# EAGLE design fra_500k_4M (EAGLE 9.6.2)
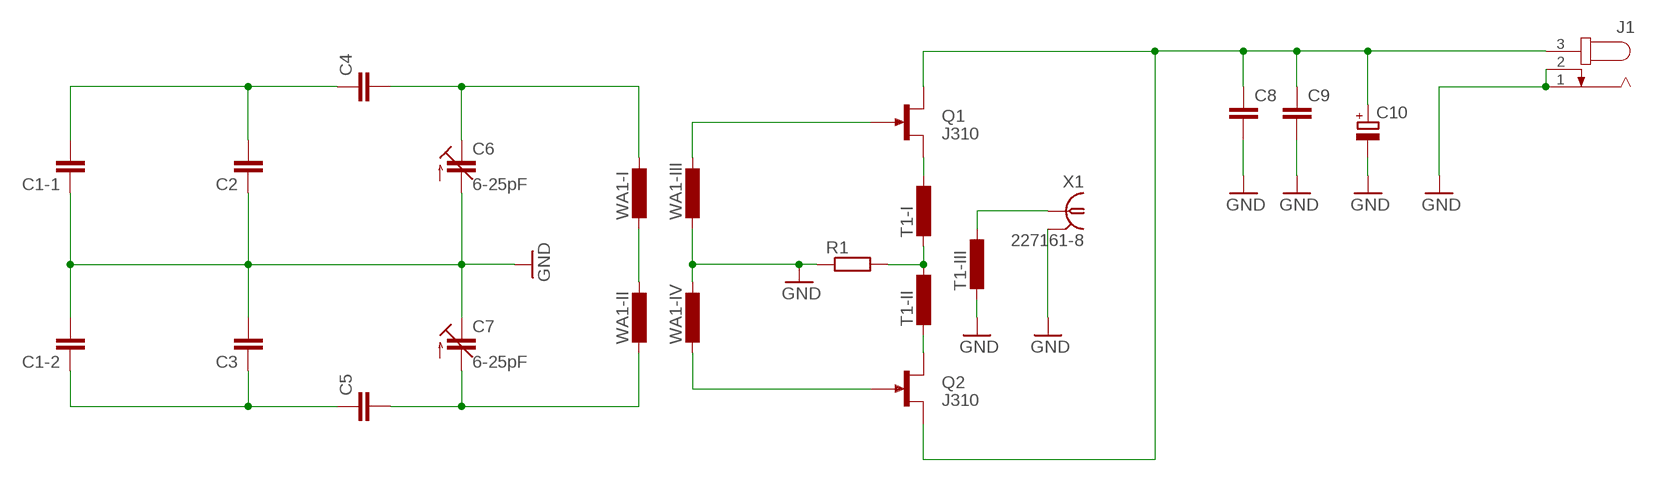
[diagram p0: schematic, sheet 1]

## Parts
C1-1  C-EU075-032X103  [C075-032X103]
C1-2  C-EU075-032X103  [C075-032X103]
C2  C-EUC1210  [C1210]
C3  C-EUC1210  [C1210]
C4  C-EUC1210  [C1210]
C5  C-EUC1210  [C1210]
C6  6-25pF  C-TRIMM3050.504  [CTRIM3050.504]
C7  6-25pF  C-TRIMM3050.504  [CTRIM3050.504]
C8  C-EUC1206  [C1206]
C9  C-EUC1206  [C1206]
C10  CPOL-EUSMCC  [SMC_C]
J1  JACK-PLUG0  [SPC4077]
Q1  J310  [TO92R]
Q2  J310  [TO92R]
R1  R-EU_M1206  [M1206]
T1-I  L-EU0204/7  [0204/7]
T1-II  L-EU0204/7  [0204/7]
T1-III  L-EU0204/7  [0204/7]
WA1-I  L-EU0204/7  [0204/7]
WA1-II  L-EU0204/7  [0204/7]
WA1-III  L-EU0204/7  [0204/7]
WA1-IV  L-EU0204/7  [0204/7]
X1  227161-8  [AMP_227161]

## Nets
GND: C1-1.1 C1-2.2 C2.1 C3.2 C6.2(A) C7.1(E) C8.2 C9.2 C10.- J1.1 J1.2 R1.1 T1-III.2 WA1-III.2 WA1-IV.1 X1.2
N$1: Q1.G WA1-III.1
N$2: Q2.G WA1-IV.2
N$3: T1-III.1 X1.1
N$4: Q1.S T1-I.1
N$5: R1.2 T1-I.2 T1-II.1
N$6: Q2.D T1-II.2
N$7: C8.1 C9.1 C10.+ J1.3 Q1.D Q2.S
N$8: C4.2 C6.1(E) WA1-I.1
N$9: C1-1.2 C2.2 C4.1
N$11: C1-2.1 C3.1 C5.1
N$12: C5.2 C7.2(A) WA1-II.2
N$13: WA1-I.2 WA1-II.1

## Library data of the parts
C1-1 C1-2 C2-C5 C8 C9 = rcl:C-EU: CAPACITOR, European symbol; SPICEPREFIX: C
C6 C7 = rcl:C-TRIMM: Trimm capacitor; SPICEPREFIX: C
C10 = rcl:CPOL-EU: POLARIZED CAPACITOR, European symbol; SPICEPREFIX: C
J1 = con-jack:JACK-PLUG: DC POWER JACK Power Jack, DC, Right Angle, Through Hole, Rated 5A at 16VDC, PC Terminals Distributor: Farnell (www.Farnell.de) Drawing: 84N1161.pdf / 84N1162.pdf Manufacturer: SPC Technology (www.spctechnology.com) Type: SPC4077 / SPC 4078; OC_FARNELL: unknown; OC_NEWARK: unknown
Q1 Q2 = transistor-small-signal:J310: N-Channel RF Amplifier J309, J310 Source: http://www.fairchildsemi.com/pf/J3/J310.html
R1 = rcl:R-EU_: RESISTOR, European symbol; SPICEPREFIX: R
T1-I T1-II T1-III WA1-I WA1-II WA1-III WA1-IV = rcl:L-EU: INDUCTOR, European symbol; SPICEPREFIX: L
X1 = con-coax:?227161*: JACK, RIGHT ANGLE, 50 OHM, PCB, BNC Source: amp_227161.pdf; OC_FARNELL: unknown; OC_NEWARK: unknown

## Board
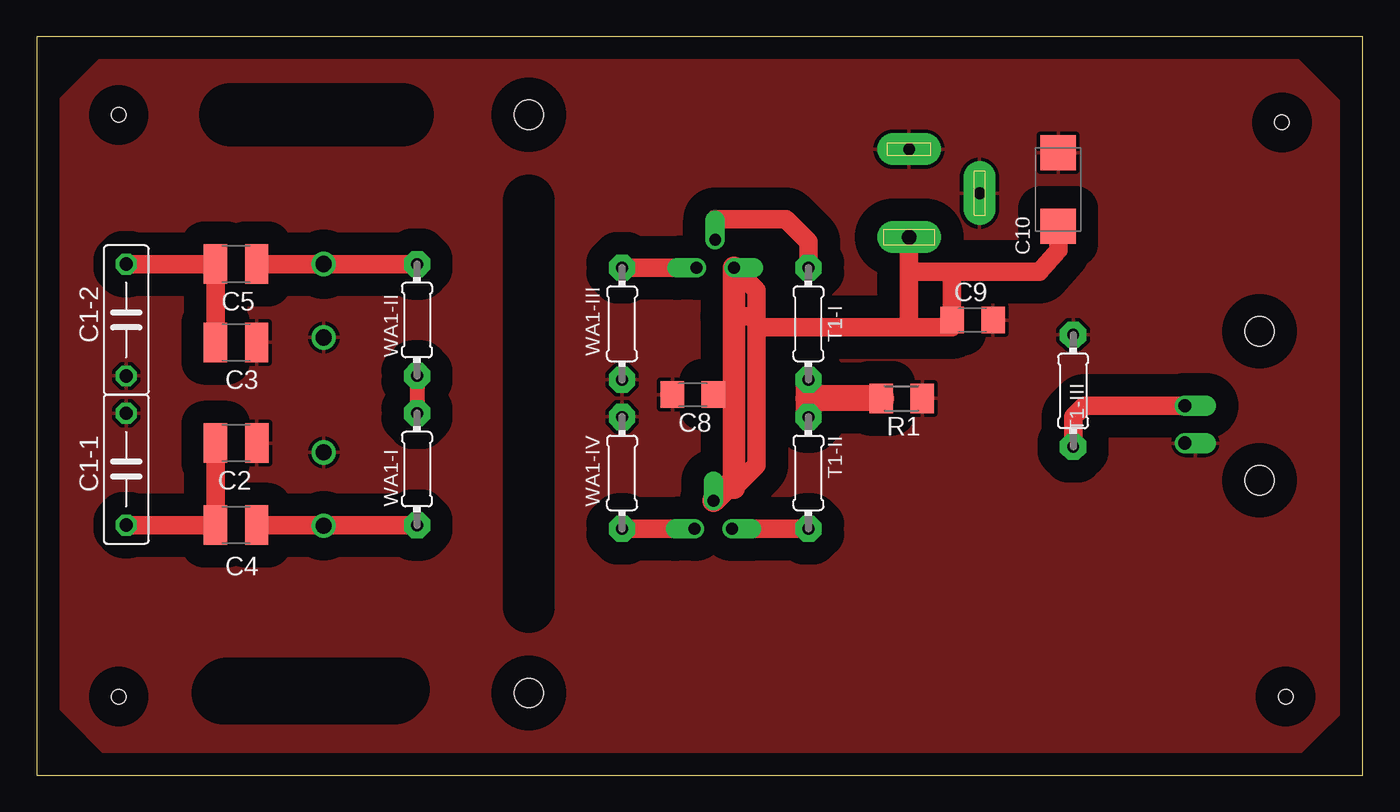
[diagram p1: board, top side]
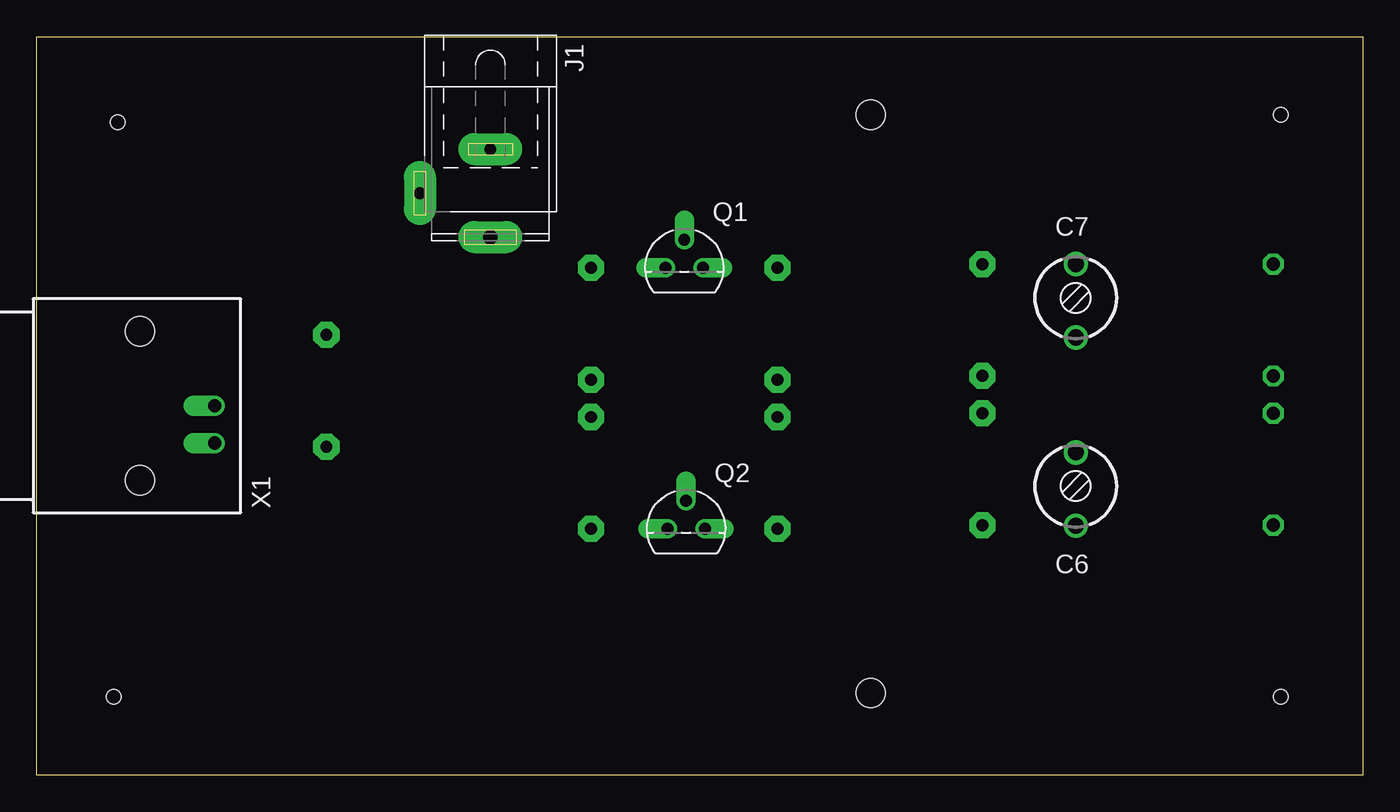
[diagram p2: board, bottom side, seen from below]

Size 90.35 x 50.28 mm. Coordinates in mm from the lower left corner, seen from the top.
Outline: 0,0 90.35,0 90.35,50.28 0,50.28 0,0
Copper layers (1*16): Top 0.035mm / dielectric 1.5mm / Bottom 0.035mm
Design rules "default": minimum track width 6mil, minimum drill 0.35mm, track to track 6mil, track to pad 6mil, pad to pad 6mil, via to via 6mil, smd to smd 6mil, copper to edge 40mil, drill to drill 6mil, minimum pad ring 10mil, minimum via ring 8mil, stop-mask expansion 4mil, vias tented up to drill 0mil, thermal gap 10mil
Holes 2 mm at 33.53,44.96 33.53,5.59
Holes 1 mm at 84.84,44.45 85.09,5.33 5.59,5.33 5.59,44.96
tRestrict: 8 lines

### Footprints (pad centres in the part's own frame; a part is rotated, then mirrored left to right if it is on the bottom)
C075-032X103 = drill 0.914 octagon: 1 -3.81,0; 2 3.81,0
C1210 = smd 1.6 x 2.7: 1 -1.4,0; 2 1.4,0
CTRIM3050.504 = drill 1.1: 1 -2.5,0; 2 2.5,0
C1206 = smd 1.6 x 1.8: 1 -1.4,0; 2 1.4,0
SMC_C = smd 2.4 x 2.4: + -2.5,0; - 2.5,0
SPC4077 = drill 0.8 pad 2.184 long: 1 -3,0; 2 0,-4.8 | drill 1 pad 2.184 long: 3 3,0
TO92R = drill 0.813 offset: D -1.27,0; G 1.27,0; S 0,1.905
M1206 = smd 1.6 x 2: 1 -1.4,0; 2 1.4,0
0204/7 = drill 0.813 pad 1.778 octagon: 1 -3.81,0; 2 3.81,0
AMP_227161 = drill 0.9 pad 1.27 offset: 1 0,-5.08; 2 -2.54,-5.08 | hole 2: -5.08,0; 5.08,0

### Placement (x,y rotation side)
C1-1  6.1,20.83 270 top
C1-2  6.1,30.99 270 top
C2  13.59,22.61 180 top
C3  13.59,29.46 0 top
C4  13.59,17.02 0 top
C5  13.59,34.8 0 top
C6  19.56,19.47 90 bottom
C7  19.56,32.3 90 bottom
C8  44.7,25.91 180 top
C9  63.75,30.99 0 top
C10  69.6,39.88 90 top
J1  59.44,39.62 270 bottom
Q1  46.23,34.54 0 bottom
Q2  46.1,16.76 0 bottom
R1  58.93,25.65 180 top
T1-I  52.58,30.73 270 top
T1-II  52.58,20.57 270 top
T1-III  70.61,26.16 90 top
WA1-I  25.91,20.83 90 top
WA1-II  25.91,30.99 90 top
WA1-III  39.88,30.73 270 top
WA1-IV  39.88,20.57 270 top
X1  83.31,25.15 90 bottom

### Tracks (layer width: path | path; a pad name or v marks a point on that pad's centre or on a via)
GND
  pour Top (isolate 1.524): -1.27,52.07 -1.27,-2.03 92.46,-2.03 92.46,52.07
N$1
  Top 1.27: Q1.G WA1-III.1
N$2
  Top 1.27: WA1-IV.2 Q2.G
N$3
  Top 1.27: X1.1 71.37,25.15 70.61,24.38 T1-III.1
N$4
  Top 1.27: Q1.S 46.23,37.85 51.05,37.85 52.58,36.32 T1-I.1
N$5
  Top 1.016: 52.58,25.65 T1-II.1
  Top 1.778: T1-I.2 T1-II.1 | R1.2 52.58,25.65
N$6
  Top 1.27: T1-II.2 Q2.D
N$7
  Top 1.27: 47.5,31.24 49.02,31.24 | 49.02,31.24 49.02,30.48 | 49.02,30.48 49.02,21.08 47.5,19.56 | 49.02,31.24 49.02,33.02 Q1.D | J1.3 59.44,34.29 | 59.44,34.29 59.44,30.48 | 49.02,30.48 59.44,30.48 | C10.+ 69.6,35.73 68.31,34.29 62.35,34.29 | 62.35,34.29 59.44,34.29 | 62.35,34.29 C9.1 62.35,30.48 59.44,30.48
  Top 1.524: Q1.D 47.5,31.24 47.5,25.65 | 47.5,25.65 47.5,20.07 | 47.5,20.07 47.5,19.56 | 47.5,20.07 Q2.S | C8.1 47.24,25.91 47.5,25.65
N$8
  Top 1.27: C4.2 19.56,17.02 | 19.56,17.02 C6.1 | WA1-I.1 19.56,17.02
N$9
  Top 1.27: C1-1.2 C4.1 C2.2
N$11
  Top 1.27: C1-2.1 C5.1 C3.1
N$12
  Top 1.27: C5.2 C7.2 WA1-II.2
N$13
  Top 1.016: WA1-II.1 WA1-I.2